# EAGLE design iv-12-tube-board-v2 (EAGLE 7.7.0)

## Sheet 1 of 2
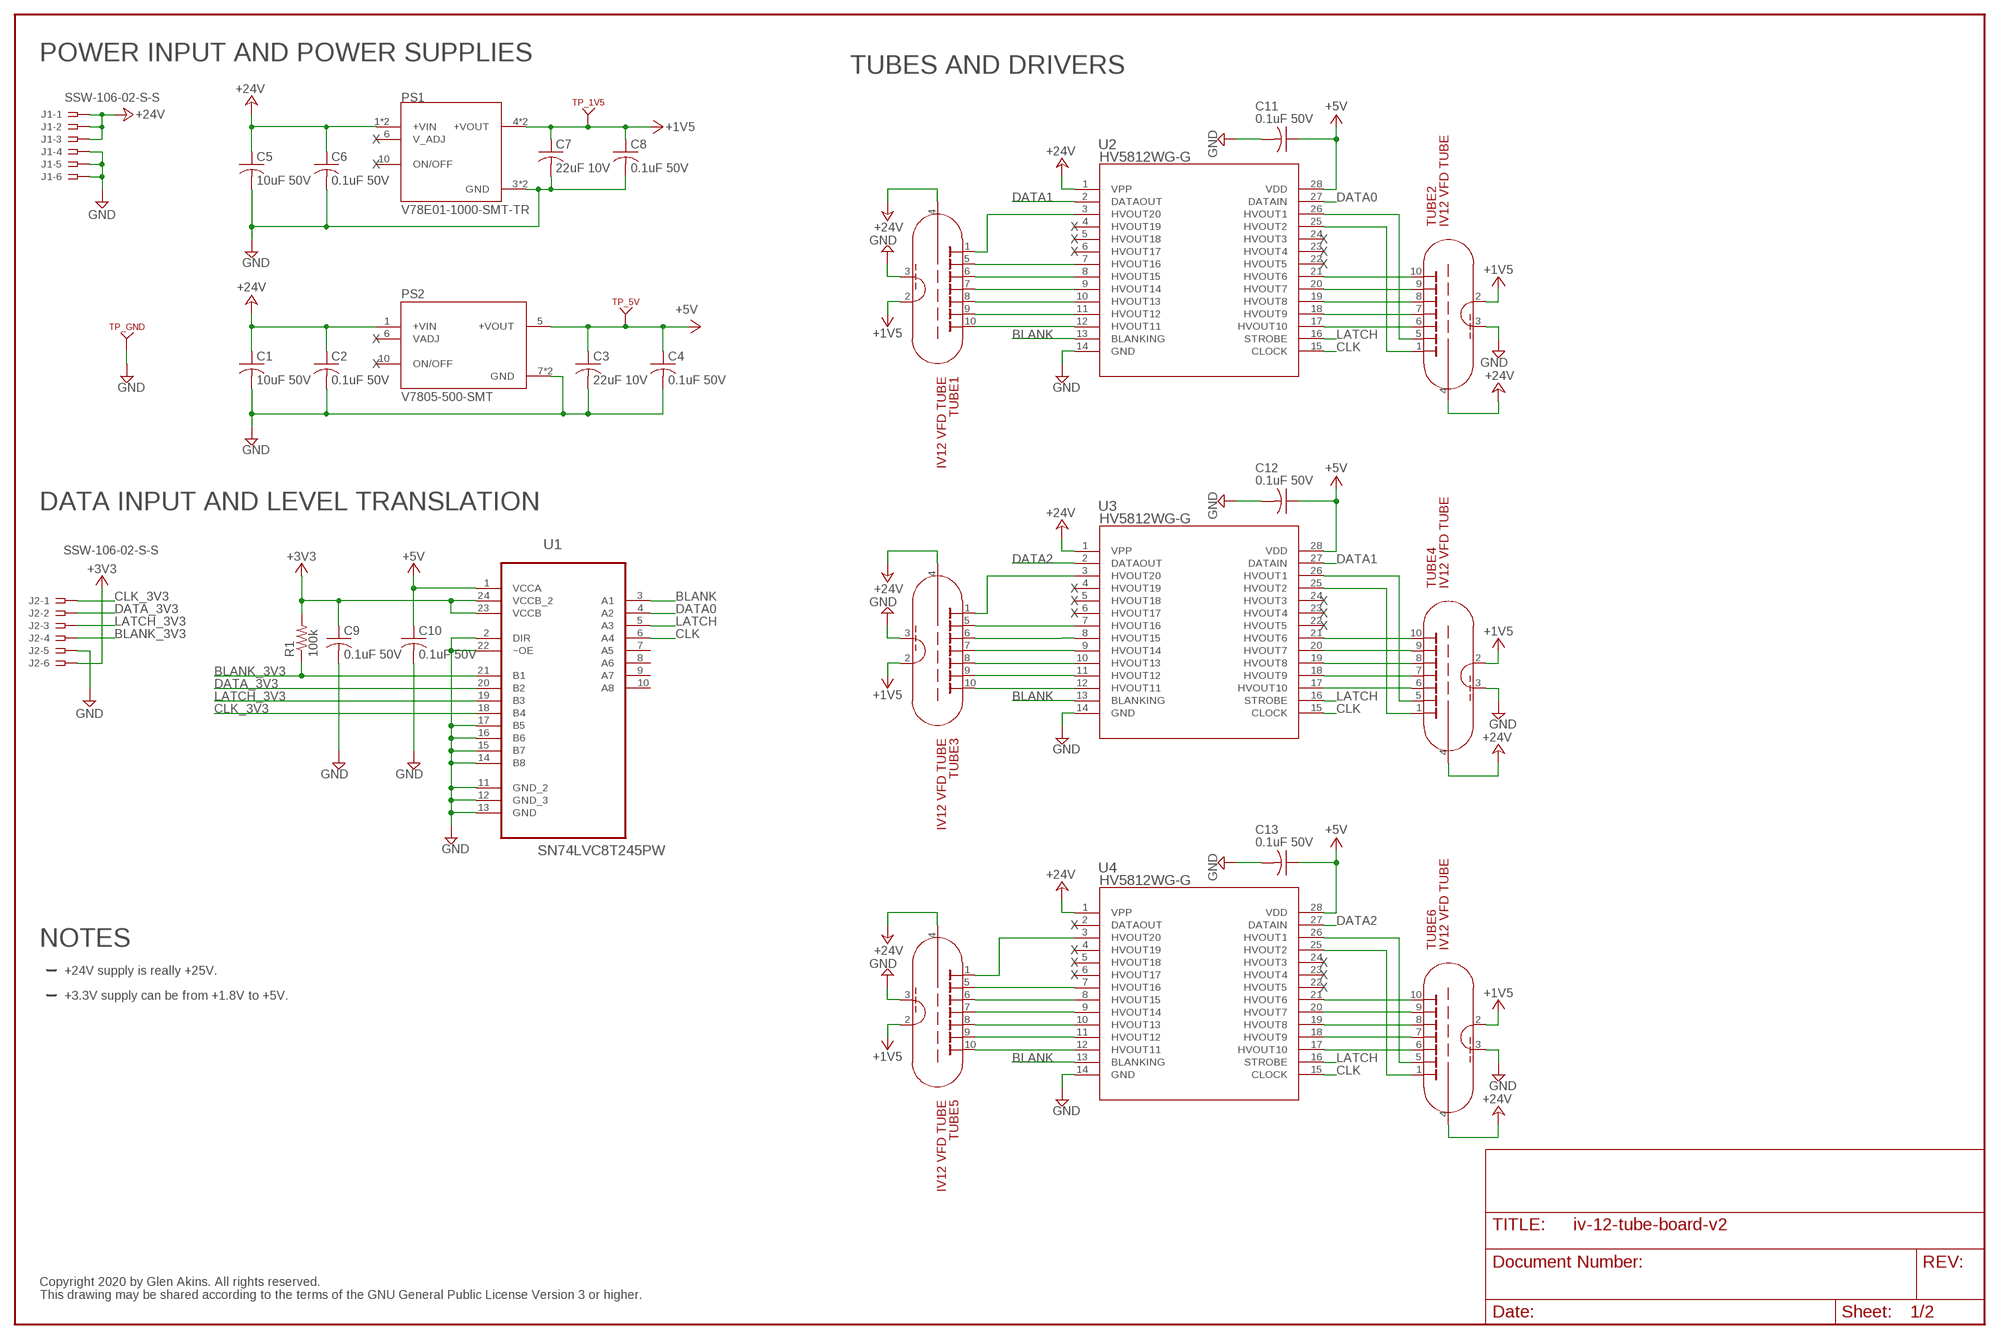
[diagram p0: schematic, sheet 1]

### Parts
C1  10uF 50V  C-USC1210K  [C1210K]
C2  0.1uF 50V  C-USC1206K  [C1206K]
C3  22uF 10V  C-USC1206K  [C1206K]
C4  0.1uF 50V  C-USC1206K  [C1206K]
C5  10uF 50V  C-USC1210K  [C1210K]
C6  0.1uF 50V  C-USC1206K  [C1206K]
C7  22uF 10V  C-USC1206K  [C1206K]
C8  0.1uF 50V  C-USC1206K  [C1206K]
C9  0.1uF 50V  C-USC0805K  [C0805K]
C10  0.1uF 50V  C-USC0805K  [C0805K]
C11  0.1uF 50V  C-USC0805  [C0805]
C12  0.1uF 50V  C-USC0805  [C0805]
C13  0.1uF 50V  C-USC0805  [C0805]
J1  SSW-106-02-S-S  [SSW-106-02-S-S]
J2  SSW-106-02-S-S  [SSW-106-02-S-S]
PS1  V78E01-1000-SMT-TR  [CONV_V78E01-1000-SMT-TR]
PS2  V7805-500-SMT  [CONV_V7805-500-SMT]
R1  100k  R-US_R0805  [R0805]
TP_1V5  KEYSTONE_500X  [KEYSTONE_TP500X]
TP_5V  KEYSTONE_500X  [KEYSTONE_TP500X]
TP_GND  KEYSTONE_500X  [KEYSTONE_TP500X]
TUBE1  IV12 VFD TUBE  IV-12-VFD-TUBE  [IV-12-VFD-TUBE-11.9MM-10PIN-34DEG]
TUBE2  IV12 VFD TUBE  IV-12-VFD-TUBE  [IV-12-VFD-TUBE-11.9MM-10PIN-34DEG]
TUBE3  IV12 VFD TUBE  IV-12-VFD-TUBE  [IV-12-VFD-TUBE-11.9MM-10PIN-34DEG]
TUBE4  IV12 VFD TUBE  IV-12-VFD-TUBE  [IV-12-VFD-TUBE-11.9MM-10PIN-34DEG]
TUBE5  IV12 VFD TUBE  IV-12-VFD-TUBE  [IV-12-VFD-TUBE-11.9MM-10PIN-34DEG]
TUBE6  IV12 VFD TUBE  IV-12-VFD-TUBE  [IV-12-VFD-TUBE-11.9MM-10PIN-34DEG]
U1  SN74LVC8T245PW  SN74AVC8T245PW  [SOP65P640X120-24N]
U2  HV5812WG-G  [SOW28_17P90X7P50]
U3  HV5812WG-G  [SOW28_17P90X7P50]
U4  HV5812WG-G  [SOW28_17P90X7P50]

### Nets
+1V5: C7.1 C8.1 PS1.4(+VOUT) PS1.5(+VOUT) TP_1V5.1 TUBE1.2 TUBE2.2 TUBE3.2 TUBE4.2 TUBE5.2 TUBE6.2
+3V3: C9.1 J2.6 R1.2 U1.23(VCCB) U1.24(VCCB_2)
+5V: C3.1 C4.1 C10.1 C11.1 C12.1 C13.1 PS2.5(+VOUT) TP_5V.1 U1.1(VCCA) U2.28(VDD) U3.28(VDD) U4.28(VDD)
+24V: C1.1 C2.1 C5.1 C6.1 J1.1 J1.2 J1.3 PS1.1(+VIN) PS1.2(+VIN) PS2.1(+VIN) TUBE1.4 TUBE2.4 TUBE3.4 TUBE4.4 TUBE5.4 TUBE6.4 U2.1(VPP) U3.1(VPP) U4.1(VPP)
BLANK: U1.3(A1) U2.13(BLANKING) U3.13(BLANKING) U4.13(BLANKING)
BLANK_3V3: J2.4 R1.1 U1.21(B1)
CLK: U1.6(A4) U2.15(CLOCK) U3.15(CLOCK) U4.15(CLOCK)
CLK_3V3: J2.1 U1.18(B4)
DATA0: U1.4(A2) U2.27(DATAIN)
DATA1: U2.2(DATAOUT) U3.27(DATAIN)
DATA2: U3.2(DATAOUT) U4.27(DATAIN)
DATA_3V3: J2.2 U1.20(B2)
GND: C1.2 C2.2 C3.2 C4.2 C5.2 C6.2 C7.2 C8.2 C9.2 C10.2 C11.2 C12.2 C13.2 J1.4 J1.5 J1.6 J2.5 PS1.3(GND) PS1.7(GND) PS2.7(GND) PS2.9(GND) TP_GND.1 TUBE1.3 TUBE2.3 TUBE3.3 TUBE4.3 TUBE5.3 TUBE6.3 U1.2(DIR) U1.11(GND_2) U1.12(GND_3) U1.13(GND) U1.14(B8) U1.15(B7) U1.16(B6) U1.17(B5) U1.22(~OE) U2.14(GND) U3.14(GND) U4.14(GND)
LATCH: U1.5(A3) U2.16(STROBE) U3.16(STROBE) U4.16(STROBE)
LATCH_3V3: J2.3 U1.19(B3)
N$1: TUBE1.1 U2.3(HVOUT20)
N$2: TUBE1.10 U2.12(HVOUT11)
N$3: TUBE1.9 U2.11(HVOUT12)
N$4: TUBE1.8 U2.10(HVOUT13)
N$5: TUBE1.7 U2.9(HVOUT14)
N$6: TUBE1.6 U2.8(HVOUT15)
N$7: TUBE1.5 U2.7(HVOUT16)
N$8: TUBE2.1 U2.25(HVOUT2)
N$9: TUBE2.5 U2.26(HVOUT1)
N$10: TUBE2.6 U2.17(HVOUT10)
N$11: TUBE2.7 U2.18(HVOUT9)
N$12: TUBE2.8 U2.19(HVOUT8)
N$13: TUBE2.9 U2.20(HVOUT7)
N$14: TUBE2.10 U2.21(HVOUT6)
N$15: TUBE3.1 U3.3(HVOUT20)
N$16: TUBE5.1 U4.3(HVOUT20)
N$17: TUBE3.5 U3.7(HVOUT16)
N$18: TUBE3.6 U3.8(HVOUT15)
N$19: TUBE3.7 U3.9(HVOUT14)
N$20: TUBE3.8 U3.10(HVOUT13)
N$21: TUBE3.9 U3.11(HVOUT12)
N$22: TUBE3.10 U3.12(HVOUT11)
N$23: TUBE5.10 U4.12(HVOUT11)
N$24: TUBE5.9 U4.11(HVOUT12)
N$25: TUBE5.8 U4.10(HVOUT13)
N$26: TUBE5.7 U4.9(HVOUT14)
N$27: TUBE5.6 U4.8(HVOUT15)
N$28: TUBE5.5 U4.7(HVOUT16)
N$29: TUBE4.5 U3.26(HVOUT1)
N$30: TUBE4.1 U3.25(HVOUT2)
N$31: TUBE4.10 U3.21(HVOUT6)
N$32: TUBE4.9 U3.20(HVOUT7)
N$33: TUBE4.8 U3.19(HVOUT8)
N$34: TUBE4.7 U3.18(HVOUT9)
N$35: TUBE4.6 U3.17(HVOUT10)
N$36: TUBE6.6 U4.17(HVOUT10)
N$37: TUBE6.7 U4.18(HVOUT9)
N$38: TUBE6.8 U4.19(HVOUT8)
N$39: TUBE6.9 U4.20(HVOUT7)
N$40: TUBE6.10 U4.21(HVOUT6)
N$41: TUBE6.5 U4.26(HVOUT1)
N$42: TUBE6.1 U4.25(HVOUT2)
Unconnected: PS1.6(V_ADJ) PS1.10(ON/OFF) PS2.6(VADJ) PS2.10(ON/OFF) U1.7(A5) U1.8(A6) U1.9(A7) U1.10(A8) U2.4(HVOUT19) U2.5(HVOUT18) U2.6(HVOUT17) U2.22(HVOUT5) U2.23(HVOUT4) U2.24(HVOUT3) U3.4(HVOUT19) U3.5(HVOUT18) U3.6(HVOUT17) U3.22(HVOUT5) U3.23(HVOUT4) U3.24(HVOUT3) U4.2(DATAOUT) U4.4(HVOUT19) U4.5(HVOUT18) U4.6(HVOUT17) U4.22(HVOUT5) U4.23(HVOUT4) U4.24(HVOUT3)

### Notes on the sheet
- POWER INPUT AND POWER SUPPLIES
- TUBES AND DRIVERS
- X
- X
- X
- X | X
- X | X
- X
- X
- X
- DATA INPUT AND LEVEL TRANSLATION
- X
- X | X
- X | X
- X
- X
- NOTES
- X
- X | X
- +24V supply is really +25V. | X | X
- X
- +3.3V supply can be from +1.8V to +5V.
- Copyright 2020 by Glen Akins. All rights reserved.
  This drawing may be shared according to the terms of the GNU General Public License Version 3 or higher.

## Sheet 2 of 2
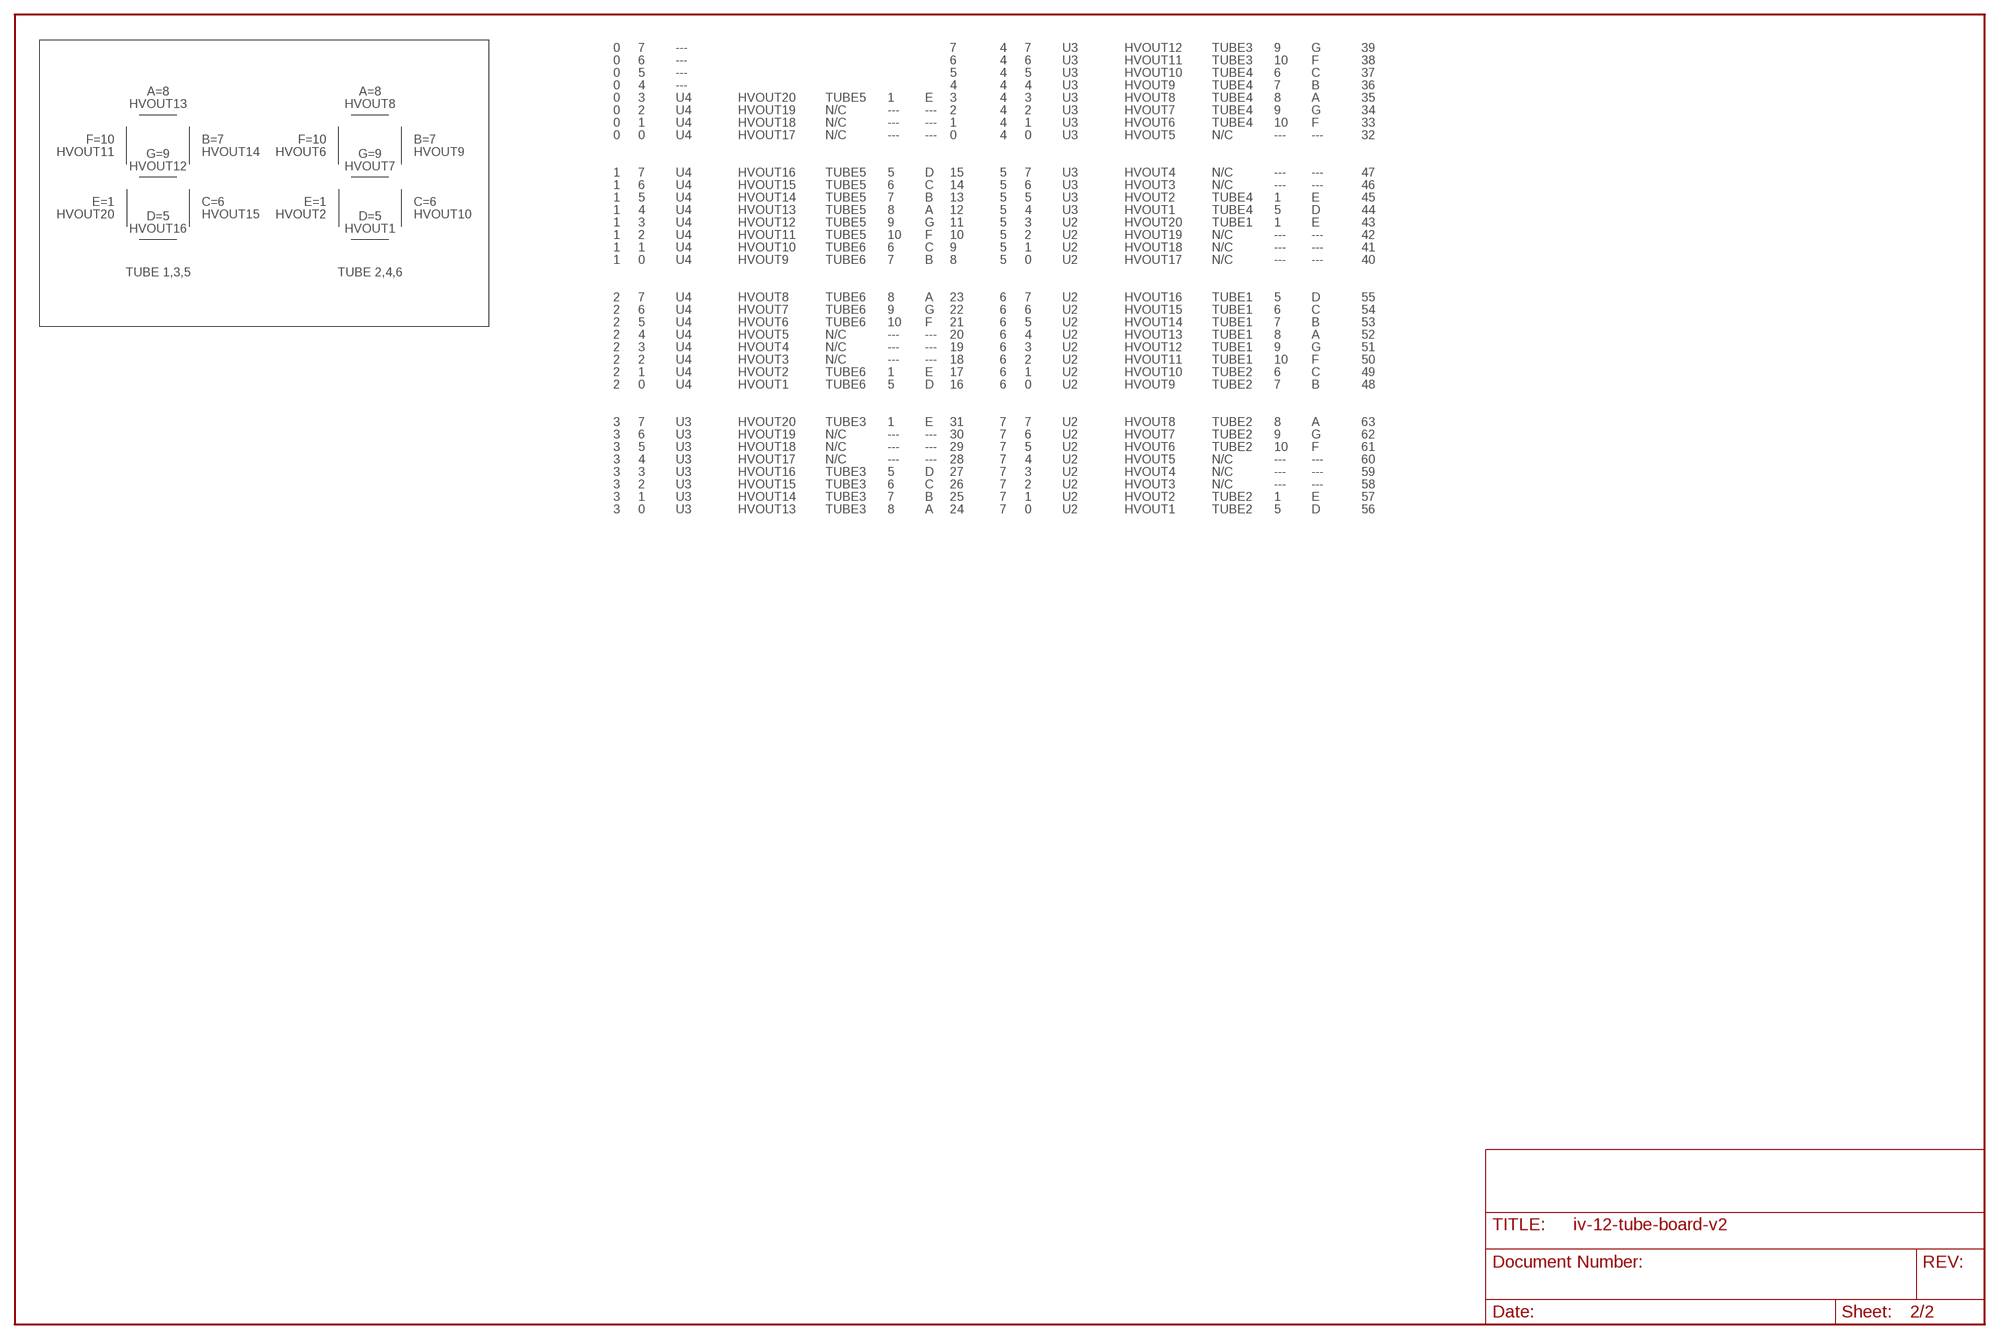
[diagram p1: schematic, sheet 2]

### Notes on the sheet
- 0 | 7 | --- | 7 | 4 | 7 | U3 | HVOUT12 | TUBE3 | 9 | G | 39
- 0 | 6 | --- | 6 | 4 | 6 | U3 | HVOUT11 | TUBE3 | 10 | F | 38
- 0 | 5 | --- | 5 | 4 | 5 | U3 | HVOUT10 | TUBE4 | 6 | C | 37
- 0 | 4 | --- | 4 | 4 | 4 | U3 | HVOUT9 | TUBE4 | 7 | B | 36
- A=8 | A=8
- 0 | 3 | U4 | HVOUT20 | TUBE5 | 1 | E | 3 | 4 | 3 | U3 | HVOUT8 | TUBE4 | 8 | A | 35
- HVOUT13 | HVOUT8
- 0 | 2 | U4 | HVOUT19 | N/C | --- | --- | 2 | 4 | 2 | U3 | HVOUT7 | TUBE4 | 9 | G | 34
- 0 | 1 | U4 | HVOUT18 | N/C | --- | --- | 1 | 4 | 1 | U3 | HVOUT6 | TUBE4 | 10 | F | 33
- F=10 | B=7 | F=10 | B=7 | 0 | 0 | U4 | HVOUT17 | N/C | --- | --- | 0 | 4 | 0 | U3 | HVOUT5 | N/C | --- | --- | 32
- HVOUT11 | HVOUT14 | HVOUT6 | HVOUT9
- G=9 | G=9
- HVOUT12 | HVOUT7
- 1 | 7 | U4 | HVOUT16 | TUBE5 | 5 | D | 15 | 5 | 7 | U3 | HVOUT4 | N/C | --- | --- | 47
- 1 | 6 | U4 | HVOUT15 | TUBE5 | 6 | C | 14 | 5 | 6 | U3 | HVOUT3 | N/C | --- | --- | 46
- E=1 | C=6 | E=1 | C=6 | 1 | 5 | U4 | HVOUT14 | TUBE5 | 7 | B | 13 | 5 | 5 | U3 | HVOUT2 | TUBE4 | 1 | E | 45
- HVOUT20 | HVOUT15 | HVOUT2 | HVOUT10 | 1 | 4 | U4 | HVOUT13 | TUBE5 | 8 | A | 12 | 5 | 4 | U3 | HVOUT1 | TUBE4 | 5 | D | 44
- D=5 | D=5
- 1 | 3 | U4 | HVOUT12 | TUBE5 | 9 | G | 11 | 5 | 3 | U2 | HVOUT20 | TUBE1 | 1 | E | 43
- HVOUT16 | HVOUT1
- 1 | 2 | U4 | HVOUT11 | TUBE5 | 10 | F | 10 | 5 | 2 | U2 | HVOUT19 | N/C | --- | --- | 42
- 1 | 1 | U4 | HVOUT10 | TUBE6 | 6 | C | 9 | 5 | 1 | U2 | HVOUT18 | N/C | --- | --- | 41
- 1 | 0 | U4 | HVOUT9 | TUBE6 | 7 | B | 8 | 5 | 0 | U2 | HVOUT17 | N/C | --- | --- | 40
- TUBE 1,3,5 | TUBE 2,4,6
- 2 | 7 | U4 | HVOUT8 | TUBE6 | 8 | A | 23 | 6 | 7 | U2 | HVOUT16 | TUBE1 | 5 | D | 55
- 2 | 6 | U4 | HVOUT7 | TUBE6 | 9 | G | 22 | 6 | 6 | U2 | HVOUT15 | TUBE1 | 6 | C | 54
- 2 | 5 | U4 | HVOUT6 | TUBE6 | 10 | F | 21 | 6 | 5 | U2 | HVOUT14 | TUBE1 | 7 | B | 53
- 2 | 4 | U4 | HVOUT5 | N/C | --- | --- | 20 | 6 | 4 | U2 | HVOUT13 | TUBE1 | 8 | A | 52
- 2 | 3 | U4 | HVOUT4 | N/C | --- | --- | 19 | 6 | 3 | U2 | HVOUT12 | TUBE1 | 9 | G | 51
- 2 | 2 | U4 | HVOUT3 | N/C | --- | --- | 18 | 6 | 2 | U2 | HVOUT11 | TUBE1 | 10 | F | 50
- 2 | 1 | U4 | HVOUT2 | TUBE6 | 1 | E | 17 | 6 | 1 | U2 | HVOUT10 | TUBE2 | 6 | C | 49
- 2 | 0 | U4 | HVOUT1 | TUBE6 | 5 | D | 16 | 6 | 0 | U2 | HVOUT9 | TUBE2 | 7 | B | 48
- 3 | 7 | U3 | HVOUT20 | TUBE3 | 1 | E | 31 | 7 | 7 | U2 | HVOUT8 | TUBE2 | 8 | A | 63
- 3 | 6 | U3 | HVOUT19 | N/C | --- | --- | 30 | 7 | 6 | U2 | HVOUT7 | TUBE2 | 9 | G | 62
- 3 | 5 | U3 | HVOUT18 | N/C | --- | --- | 29 | 7 | 5 | U2 | HVOUT6 | TUBE2 | 10 | F | 61
- 3 | 4 | U3 | HVOUT17 | N/C | --- | --- | 28 | 7 | 4 | U2 | HVOUT5 | N/C | --- | --- | 60
- 3 | 3 | U3 | HVOUT16 | TUBE3 | 5 | D | 27 | 7 | 3 | U2 | HVOUT4 | N/C | --- | --- | 59
- 3 | 2 | U3 | HVOUT15 | TUBE3 | 6 | C | 26 | 7 | 2 | U2 | HVOUT3 | N/C | --- | --- | 58
- 3 | 1 | U3 | HVOUT14 | TUBE3 | 7 | B | 25 | 7 | 1 | U2 | HVOUT2 | TUBE2 | 1 | E | 57
- 3 | 0 | U3 | HVOUT13 | TUBE3 | 8 | A | 24 | 7 | 0 | U2 | HVOUT1 | TUBE2 | 5 | D | 56

## Library data of the parts
C1 C5 = rcl:C-US: CAPACITOR, American symbol; MFR: KEMET; MFR_PART_NO: C1210C106K5RACTU
C2 C4 C6 C8 = rcl:C-US: CAPACITOR, American symbol; MFR: KEMET; MFR_PART_NO: C1206S104M5RACTU
C3 C7 = rcl:C-US: CAPACITOR, American symbol; MFR: KEMET; MFR_PART_NO: C1206C226K8RAC7800
C9-C13 = rcl:C-US: CAPACITOR, American symbol
J1 J2 = con-samtec:SSW-106-02-S-S: THROUGH-HOLE .025" SQ POST SOCKET Source: Samtec SSW.pdf; MPN: SSW-106-02-S-S; OC_FARNELL: unknown; OC_NEWARK: 11P9416
PS1 = V78E01-1000-SMT-TR:V78E01-1000-SMT-TR: NON-ISOLATED DC SWITCHING REGULATOR; CUI_PURCHASE_URL: https://www.cui.com/product/dc-dc-converters/non-isolated/v78e-1000-smt-series?utm_source=snapeda.com&utm_medium=referral&utm_campaign=snapedaBOM; DESCRIPTION: 1 A Output Current, 6~36 Vdc Input, SMT, Non-Isolated, Dc-Dc Converter; DIGI-KEY_PART_NUMBER: 102-5030-1-ND; DIGI-KEY_PURCHASE_URL: https://www.digikey.com/product-detail/en/cui-inc/V78E01-1000-SMT-TR/102-5030-1-ND/9649681?utm_source=snapeda&utm_medium=aggregator&utm_campaign=symbol; MF: CUI Inc.; MP: V78E01-1000-SMT-TR; PACKAGE: SMD-10 CUI Inc.
PS2 = V7805-500-SMT:V7805-500-SMT: 1 A Output Current, 4.5~18 Vdc Input, SMT, Non-Isolated, Dc-Dc Converter; MANUFACTURER: CUI Inc; PARTREV: 1.03; STANDARD: Manufacturer recommendations
R1 = rcl:R-US_: RESISTOR, American symbol
TP_1V5 TP_5V TP_GND = 0GlenConnectors:KEYSTONE_500X
TUBE1-TUBE6 = IV-12-VFD-TUBE:IV-12-VFD-TUBE
U1 = Texas Instruments_By_element14_Batch_1:SN74AVC8T245PW: TRANSCEIVER; MPN: SN74AVC8T245PW; OC_FARNELL: 1053490; OC_NEWARK: 10J9626; PACKAGE: TSSOP-24; SUPPLIER: Texas Instruments
U2-U4 = HV5812WG:HV5812WG-G; BUILT_BY: EMA_Jessica; COPYRIGHT: Copyright (C) 2018 Accelerated Designs. All rights reserved; MANUFACTURER_PART_NUMBER: HV5812WG-G; VENDOR: Microchip

## Board
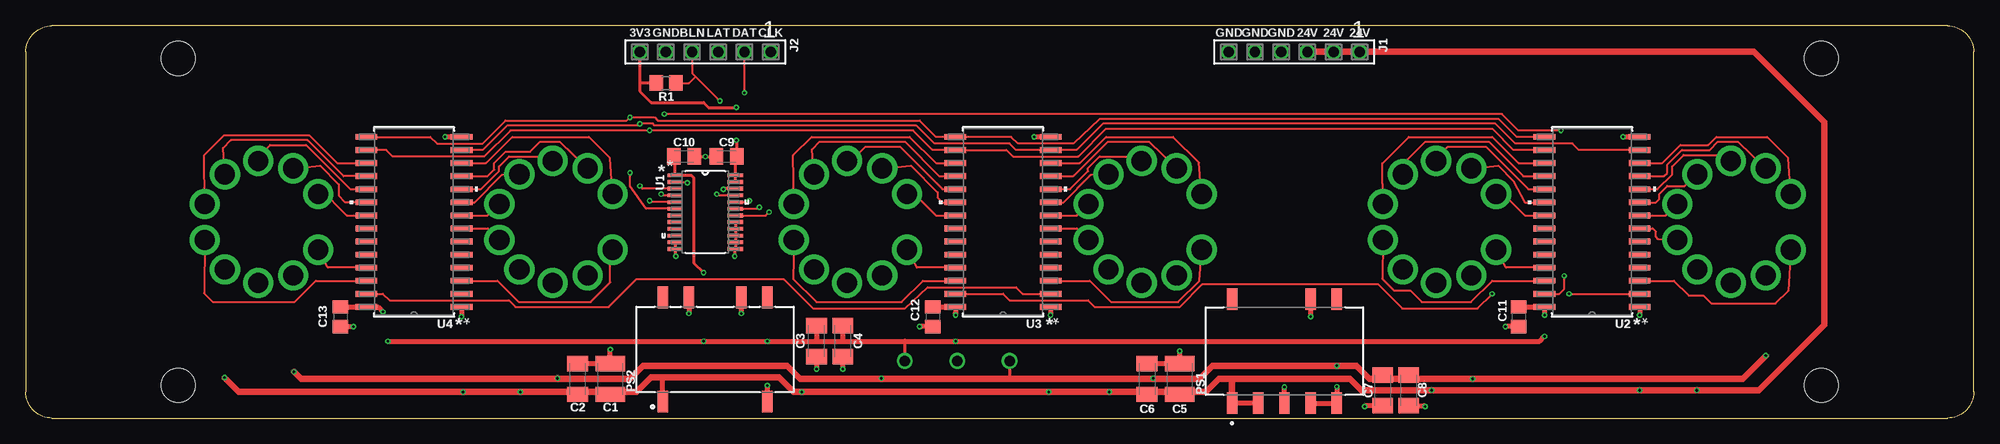
[diagram p2: board, top side]
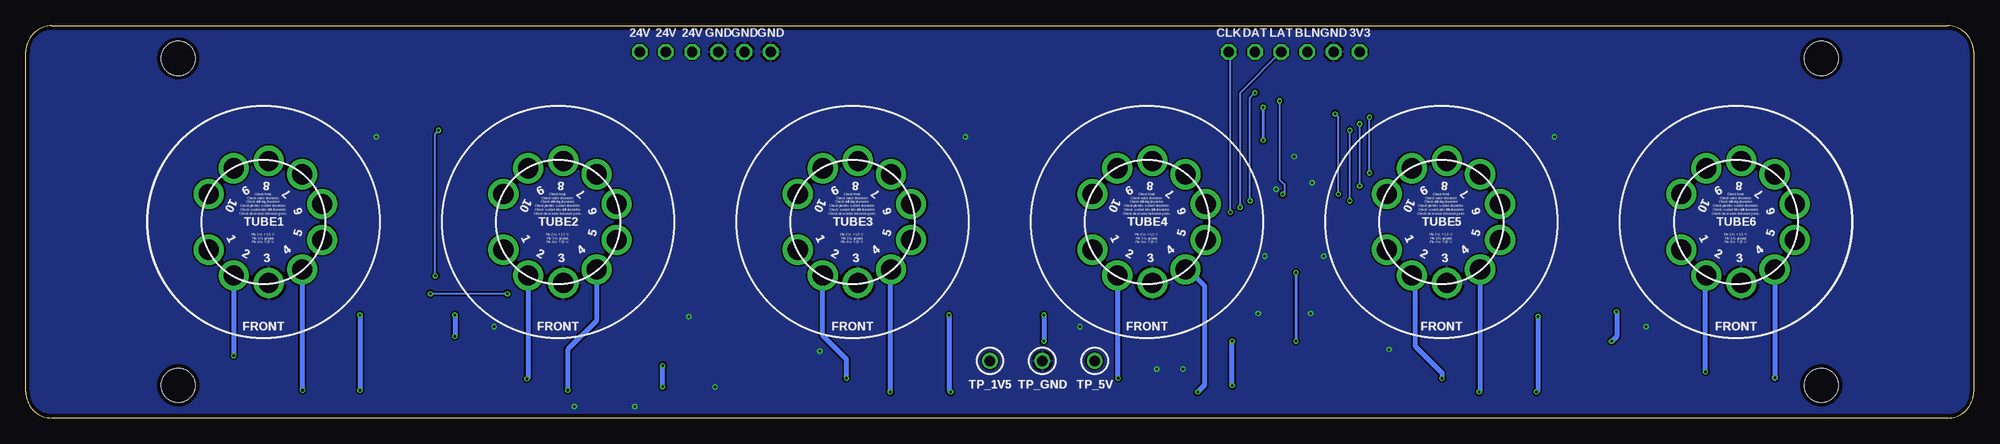
[diagram p3: board, bottom side, seen from below]

Size 189 x 38.1 mm. Coordinates in mm from the lower left corner, seen from the top.
Outline: 2.54,0 186.46,0 arc90 189,2.54 189,35.56 arc90 186.46,38.1 2.54,38.1 arc90 0,35.56 0,2.54 arc90 2.54,0
Copper layers (1*16): Top 0.035559375mm / dielectric 1.6mm / Bottom 0.035559375mm
Design rules "oshpark-2layer-2018": minimum track width 6mil, minimum drill 10mil, track to track 6mil, track to pad 6mil, pad to pad 6mil, via to via 6mil, smd to smd 6mil, copper to edge 15mil, drill to drill 6mil, minimum pad ring 5mil, minimum via ring 5mil, stop-mask expansion 2.5mil, vias tented up to drill 0mil, thermal gap 10mil
Holes 3.3 mm at 14.81,3.17 174.19,3.17 174.19,34.92 14.81,34.92

### Footprints (pad centres in the part's own frame; a part is rotated, then mirrored left to right if it is on the bottom)
C1210K = smd 1.5 x 2.9: 1 -1.5,0; 2 1.5,0
C1206K = smd 1.5 x 2: 1 -1.5,0; 2 1.5,0
C0805K = smd 1.3 x 1.6: 1 -1,0; 2 1,0
C0805 = smd 1.3 x 1.5: 1 -0.95,0; 2 0.95,0
SSW-106-02-S-S = drill 1 pad 1.5 octagon: 1 -6.35,0; 2 -3.81,0; 3 -1.27,0; 4 1.27,0; 5 3.81,0; 6 6.35,0
CONV_V78E01-1000-SMT-TR = smd 2.1 x 1: 1 -5.05,5.08; 2 -5.05,2.54; 3 -5.05,0; 4 -5.05,-2.54; 5 -5.05,-5.08; 6 5.05,-5.08; 7 5.05,-2.54; 10 5.05,5.08
CONV_V7805-500-SMT = smd 2.1 x 1: 1 -5.05,5.08; 5 -5.05,-5.08; 6 5.05,-5.08; 7 5.05,-2.54; 9 5.05,2.54; 10 5.05,5.08
R0805 = smd 1.3 x 1.5: 1 -0.95,0; 2 0.95,0
KEYSTONE_TP500X = drill 1.016: 1 0,0
IV-12-VFD-TUBE-11.9MM-10PIN-34DEG = drill 1.95 pad 2.85: 1 -5.301,-2.701; 2 -2.885,-5.204; 3 0.519,-5.927; 4 3.744,-4.624; 5 5.69,-1.74; 6 5.69,1.74; 7 3.744,4.624; 8 0.519,5.927; 9 -2.885,5.204; 10 -5.301,2.701
SOP65P640X120-24N = smd 1.473 x 0.356: 1 -2.921,3.581; 2 -2.921,2.921; 3 -2.921,2.286; 4 -2.921,1.626; 5 -2.921,0.965; 6 -2.921,0.33; 7 -2.921,-0.33; 8 -2.921,-0.965; 9 -2.921,-1.626; 10 -2.921,-2.286; 11 -2.921,-2.921; 12 -2.921,-3.581; 13 2.921,-3.581; 14 2.921,-2.921; 15 2.921,-2.286; 16 2.921,-1.626; 17 2.921,-0.965; 18 2.921,-0.33; 19 2.921,0.33; 20 2.921,0.965; 21 2.921,1.626; 22 2.921,2.286; 23 2.921,2.921; 24 2.921,3.581
SOW28_17P90X7P50 = smd 2.108 x 0.559: 1 -4.623,8.255; 2 -4.623,6.985; 3 -4.623,5.715; 4 -4.623,4.445; 5 -4.623,3.175; 6 -4.623,1.905; 7 -4.623,0.635; 8 -4.623,-0.635; 9 -4.623,-1.905; 10 -4.623,-3.175; 11 -4.623,-4.445; 12 -4.623,-5.715; 13 -4.623,-6.985; 14 -4.623,-8.255; 15 4.623,-8.255; 16 4.623,-6.985; 17 4.623,-5.715; 18 4.623,-4.445; 19 4.623,-3.175; 20 4.623,-1.905; 21 4.623,-0.635; 22 4.623,0.635; 23 4.623,1.905; 24 4.623,3.175; 25 4.623,4.445; 26 4.623,5.715; 27 4.623,6.985; 28 4.623,8.255

### Placement (x,y rotation side)
C1  56.72,3.81 90 top
C2  53.54,3.81 90 top
C3  76.72,7.46 270 top
C4  79.26,7.46 270 top
C5  111.96,3.81 90 top
C6  108.79,3.81 90 top
C7  131.65,2.7 270 top
C8  134.19,2.7 270 top
C9  67.99,25.4 180 top
C10  63.86,25.4 0 top
C11  144.82,9.84 270 top
C12  87.99,9.84 270 top
C13  30.52,9.84 270 top
J1  123.07,35.56 180 top
J2  65.92,35.56 180 top
PS1  122.12,6.51 90 top
PS2  66.88,6.67 90 top
R1  62.11,32.54 180 top
TP_1V5  95.45,5.56 180 bottom
TP_5V  85.29,5.56 180 bottom
TP_GND  90.37,5.56 180 bottom
TUBE1  165.94,19.05 0 bottom
TUBE2  137.36,19.05 0 bottom
TUBE3  108.79,19.05 0 bottom
TUBE4  80.21,19.05 0 bottom
TUBE5  51.64,19.05 0 bottom
TUBE6  23.06,19.05 0 bottom
U1  65.92,20 0 top
U2  151.97,19.05 180 top
U3  94.82,19.05 180 top
U4  37.67,19.05 180 top

### Tracks (layer width: path | path; a pad name or v marks a point on that pad's centre or on a via)
+1V5  (via drill 0.25)
  Top 0.305: TP_1V5.1 95.45,3.81
  Top 0.508: v109.37,3.86 111.33,3.81 | v83.02,3.86 82.75,3.81 | PS1.4 PS1.5 v127.2,3.05 | C7.1 131.89,4.2 132.28,3.81 | C8.1 133.94,4.2
  Top 0.61: v26.03,4.49 26.71,3.81 54.18,3.81 | 54.18,3.81 58.62,3.81 59.89,5.08 73.86,5.08 75.13,3.81 82.75,3.81 95.45,3.81 111.33,3.81 113.87,3.81 115.14,5.08 v127.2,5.08 129.11,5.08 130.38,3.81 132.28,3.81 133.55,3.81 | 133.55,3.81 v140.38,3.81 166.57,3.81 168.43,5.67 v168.82,6.06 | v51.59,3.86 54.18,3.81 | 133.94,4.2 133.55,3.81
  Bottom 0.508: v51.59,3.86 51.59,4.4 54.18,6.99 54.18,13.5 TUBE5.2 | v109.37,3.86 109.37,5.71 111.67,8.01 TUBE3.2 | v127.2,3.05 v127.2,5.08 | v26.03,4.49 26.03,13.76 TUBE6.2 | v83.02,3.86 83.02,13.77 TUBE4.2 | TUBE2.2 140.25,3.94 v140.38,3.81 | TUBE1.2 v168.82,6.06
+3V3  (via drill 0.25)
  Top 0.203: 68.84,25.26 C9.1 68.94,25.45
  Top 0.305: 68.84,25.26 U1.24 U1.23 | J2.6 59.57,32.54 | 59.57,32.54 59.57,31.75 60.69,30.64 65.77,30.64 66.24,30.16 v68.94,30.16 | v68.94,26.99 68.94,25.45 | R1.2 59.57,32.54
  Bottom 0.305: v68.94,30.16 v68.94,26.99
+5V  (via drill 0.25)
  Top 0.203: 63,25.26 C10.1
  Top 0.305: 63,25.26 U1.1 64.57,23.58 64.81,23.34 64.81,15.08 v65.77,14.13 | TP_5V.1 85.29,7.46
  Top 0.508: v34.65,10.32 34.17,10.79 U4.28 C13.1 | v35.13,7.46 v65.77,7.46 v71.96,7.46 76.88,7.46 | 76.88,7.46 79.26,7.46 | 79.26,7.46 85.29,7.46 v90.21,7.46 146.89,7.46 v147.36,7.94 | v147.36,10 147.34,10.02 U2.28 C11.1 | v90.21,10 90.19,10.18 U3.28 C12.1 | PS2.5 v71.96,3.17 | C3.1 76.72,7.62 76.88,7.46 | C4.1 79.26,7.46
  Bottom 0.305: v65.77,14.13 v65.77,7.46
  Bottom 0.508: v34.65,10.32 34.65,7.94 v35.13,7.46 | v147.36,10 v147.36,7.94 | v90.21,10 v90.21,7.46 | v71.96,3.17 v71.96,7.46
+24V  (via drill 0.25)
  Top 0.508: PS1.2 PS1.1 | C5.1 111.96,2.38 112.12,2.54 | C1.1 56.31,2.31 56.08,2.54 | C2.1 53.54,2.54 | U2.1 156.59,10.02 v156.57,10 | U3.1 99.44,10.02 v99.42,10 | U4.1 42.29,9.86 v42.27,9.84 | PS2.1 61.8,3.97
  Top 0.61: v19.29,3.93 20.68,2.54 v42.43,2.54 v47.99,2.54 53.54,2.54 56.08,2.54 59.26,2.54 60.69,3.97 61.8,3.97 73.07,3.97 74.5,2.54 v75.29,2.54 v99.26,2.54 v105.14,2.54 108.79,2.54 | 108.79,2.54 112.12,2.54 114.5,2.54 115.77,3.81 117.04,3.81 | 117.04,3.81 128.47,3.81 129.58,2.7 v136.41,2.7 v156.57,2.7 v162.13,2.7 168.16,2.7 174.51,9.05 174.51,28.73 167.68,35.56 J1.1 J1.2 J1.3 | PS1.1 117.04,3.81 | C6.1 108.79,2.54
  Bottom 0.508: TUBE4.4 76.28,14.49 74.66,12.86 74.66,3.17 v75.29,2.54 | v136.41,2.7 136.41,6.67 133.62,9.46 TUBE2.4 | v156.57,10 v156.57,2.7 | v99.42,10 99.42,2.7 v99.26,2.54 | v42.27,9.84 42.27,2.7 v42.43,2.54 | TUBE6.4 19.32,3.96 | TUBE5.4 47.89,2.63 v47.99,2.54 | TUBE3.4 105.14,14.33 v105.14,2.54 | TUBE1.4 162.19,2.76 v162.13,2.7
  Bottom 0.61: 19.32,3.96 v19.29,3.93
BLANK  (via drill 0.25)
  Top 0.203: U2.13 150.7,26.04 150.06,26.67 144.51,26.67 142.6,28.57 104.5,28.57 101.96,26.04 U3.13 96.09,26.04 95.45,26.67 88.15,26.67 86.4,28.42 61,28.42 60.84,28.57 v59.57,28.57 59.42,28.42 46.72,28.42 44.33,26.04 U4.13 | U1.3 59.83,22.29 v59.57,22.54
  Bottom 0.203: v59.57,22.54 v59.57,28.57
BLANK_3V3  (via drill 0.25)
  Top 0.203: U1.21 67.16,21.63 v67.04,21.75 | J2.4 64.66,33.5 64.97,33.18 | 64.97,33.18 v67.35,30.8 | R1.1 64.34,32.54 64.97,33.18
  Bottom 0.203: v67.35,30.8 67.35,23.18 66.88,22.7 66.88,21.91 v67.04,21.75
CLK  (via drill 0.25)
  Top 0.203: U2.15 144.66,27.3 142.92,29.05 104.18,29.05 101.64,26.67 96.25,26.67 95.61,27.3 U3.15 88.31,27.3 86.72,28.89 61.32,28.89 61,29.21 v58.62,29.21 58.31,28.89 46.56,28.89 44.33,26.67 39.89,26.67 39.25,27.3 U4.15 | U1.6 60.2,20.33 58.62,22.54 v58.62,23.81
  Bottom 0.203: v58.62,23.81 v58.62,29.21
CLK_3V3  (via drill 0.25)
  Top 0.203: U1.18 71.79,19.67 v72.12,20
  Bottom 0.203: v72.12,20 72.12,35.4 J2.1
DATA0  (via drill 0.25)
  Top 0.203: U2.27 148.79,12.06 149.27,12.54 v149.27,13.81 | v148.95,27.94 144.82,27.94 143.24,29.53 v61.96,29.53 | U1.4 61.76,21.63 v61.64,21.75
  Bottom 0.203: v149.27,13.81 149.27,27.62 v148.95,27.94 | v61.64,21.75 61.64,29.21 v61.96,29.53
DATA1  (via drill 0.25)
  Top 0.203: U3.27 94.82,12.06 95.45,11.43 103.07,11.43 103.71,10.79 111.96,10.79 114.18,13.02 131.17,13.02 133.55,10.64 140.85,10.64 v142.28,12.06 | v149.74,12.06 U2.2
  Bottom 0.203: v142.28,12.06 v149.74,12.06
DATA2
  Top 0.203: U4.27 34.65,12.06 35.29,11.43 46.88,11.43 47.51,10.79 56.56,10.79 59.26,13.49 73.55,13.49 76.4,10.64 85.29,10.64 87.51,12.7 96.09,12.7 96.72,12.06 U3.2
DATA_3V3  (via drill 0.25)
  Top 0.203: U1.20 70.06,20.97 v70.21,21.11 | v69.73,31.59 J2.2
  Bottom 0.203: v70.21,21.11 70.21,31.11 v69.73,31.59
GND  (via drill 0.25)
  Top 0.203: U1.13 68.84,16.45 68.78,16.51 | U1.2 64.11,22.92 v64.18,22.86
  Top 0.305: C10.2 v65.92,25.4 C9.2 | U1.17 U1.16 U1.15 U1.14 U1.13 | 68.78,16.51 v68.78,15.72 | U1.11 U1.12 63,15.78 v63.07,15.72 | U1.22 67.73,22.29 v67.67,22.23
  Top 0.508: PS2.7 v69.42,10.16 | PS2.9 v64.34,10.16 | PS1.7 v124.66,9.84 | PS1.3 v122.12,3.02 | C7.2 129.99,1.2 v129.9,1.11 | C8.2 135.69,1.2 v135.77,1.11 | C2.2 C1.2 v56.72,6.67 | v111.96,6.51 C5.2 C6.2 | U4.14 v40.68,27.3 | U3.14 v97.83,27.3 | U2.14 v154.98,27.3 | C4.2 v79.26,4.76 | C3.2 v76.72,4.76 | C12.2 86.88,8.89 v86.72,8.89 | C13.2 v31.79,8.89 | C11.2 v143.56,8.89 v143.55,8.89
  pour Bottom (isolate 0.152): 0,1.27 1.27,0 187.73,0 189,1.27 189,36.83 187.73,38.1 1.27,38.1 0,36.83
LATCH  (via drill 0.25)
  Top 0.203: U2.16 144.35,26.04 142.28,28.1 104.82,28.1 102.12,25.4 95.77,25.4 95.13,26.04 U3.16 87.99,26.04 86.09,27.94 v60.53,27.94 47.03,27.94 44.49,25.4 35.6,25.4 34.97,26.04 U4.16 | U1.5 60.67,20.97 v60.53,21.11
  Bottom 0.203: v60.53,21.11 v60.53,27.94
LATCH_3V3  (via drill 0.25)
  Top 0.203: U1.19 71.02,20.33 v71.16,20.48
  Bottom 0.203: v71.16,20.48 71.16,31.59 J2.3
N$1
  Top 0.203: U2.3 159.9,13.34 161.33,11.91 162.76,11.91 163.56,11.11 169.75,11.11 170.98,12.35 TUBE1.1
N$2
  Top 0.203: U2.12 158.79,24.77 160.54,26.51 163.24,26.51 164.03,27.3 168.95,27.3 170.98,25.27 TUBE1.10
N$3
  Top 0.203: U2.11 158.95,23.5 159.27,23.81 159.27,24.61 160.7,26.04 163.4,26.04 164.19,26.83 166.11,26.83 TUBE1.9
N$4
  Top 0.203: U2.10 158.32,22.23 159.75,23.65 159.75,24.45 160.86,25.56 164.51,25.56 TUBE1.8
N$5
  Top 0.203: U2.9 158.16,20.95 158.48,21.27 158.48,21.75 159.27,22.54 160.97,22.54 TUBE1.7
N$6
  Top 0.203: U2.8 159.12,19.68 TUBE1.6
N$7
  Top 0.203: U2.7 157.84,18.41 158.16,18.1 158.16,17.62 158.42,17.36 TUBE1.5
N$8
  Top 0.203: U2.25 143.61,14.61 TUBE2.1
N$9
  Top 0.203: TUBE2.5 131.6,13.54 132.76,12.38 134.35,12.38 135.46,11.27 140.22,11.27 142.28,13.34 U2.26
N$10
  Top 0.203: TUBE2.6 131.6,24.72 134.19,27.3 142.28,27.3 144.82,24.77 U2.17
N$11
  Top 0.203: TUBE2.7 133.43,24.49 135.77,26.83 141.97,26.83 145.3,23.5 U2.18
N$12
  Top 0.203: TUBE2.8 136.63,24.99 138,26.35 141.65,26.35 145.78,22.23 U2.19
N$13
  Top 0.203: TUBE2.9 142.86,24.51 144.35,23.02 145.46,20.95 U2.20
N$14
  Top 0.203: TUBE2.10 142.85,22.29 145.46,19.68 U2.21
N$15
  Top 0.203: U3.3 103.23,13.34 105.29,11.27 111.8,11.27 113.87,13.34 113.84,13.37 TUBE3.1
N$16
  Top 0.203: U4.3 45.76,13.34 47.83,11.27 54.81,11.27 56.72,13.18 56.72,15.77 TUBE5.1
N$17
  Top 0.203: U3.7 101.98,18.41 TUBE3.5
N$18
  Top 0.203: U3.8 101.98,19.68 TUBE3.6
N$19
  Top 0.203: U3.9 100.69,20.95 103.32,23.58 TUBE3.7
N$20
  Top 0.203: U3.10 101.33,22.23 103.07,23.97 103.07,24.29 104.18,25.4 107.52,25.4 TUBE3.8
N$21
  Top 0.203: U3.11 101.64,23.5 104.98,26.83 108.96,26.83 TUBE3.9
N$22
  Top 0.203: U3.12 102.28,24.77 104.82,27.3 111.33,27.3 113.84,24.8 TUBE3.10
N$23
  Top 0.203: U4.12 44.65,24.77 47.19,27.3 54.65,27.3 56.68,25.27 TUBE5.10
N$24
  Top 0.203: U4.11 44.81,23.5 45.45,24.13 45.45,24.77 46.56,25.88 48.94,25.88 49.89,26.83 51.81,26.83 TUBE5.9
N$25
  Top 0.203: U4.10 44.18,22.23 45.92,23.97 45.92,24.45 46.88,25.4 50.37,25.4 TUBE5.8
N$26
  Top 0.203: U4.9 43.54,20.95 46.17,23.58 TUBE5.7
N$27
  Top 0.203: U4.8 44.83,19.68 TUBE5.6
N$28
  Top 0.203: U4.7 44.83,18.41 TUBE5.5
N$29
  Top 0.203: TUBE4.5 74.45,13.54 76.72,11.27 84.98,11.27 87.04,13.34 U3.26
N$30
  Top 0.203: U3.25 86.46,14.61 TUBE4.1
N$31
  Top 0.203: TUBE4.10 85.7,22.29 88.31,19.68 U3.21
N$32
  Top 0.203: TUBE4.9 85.87,24.51 88.47,21.91 88.47,21.43 88.94,20.95 U3.20
N$33
  Top 0.203: TUBE4.8 80.12,24.99 81.48,26.35 84.82,26.35 88.94,22.23 U3.19
N$34
  Top 0.203: TUBE4.7 76.28,26.07 77.04,26.83 85.29,26.83 88.63,23.5 U3.18
N$35
  Top 0.203: TUBE4.6 74.45,25.52 76.24,27.3 85.77,27.3 88.31,24.77 U3.17
N$36
  Top 0.203: TUBE6.6 17.3,25.52 19.25,27.46 27.51,27.46 30.21,24.77 U4.17
N$37
  Top 0.203: U4.18 30.84,23.5 27.35,26.99 19.89,26.99 19.13,26.23 TUBE6.7
N$38
  Top 0.203: TUBE6.8 22.21,25.02 23.7,26.51 27.19,26.51 31.48,22.23 U4.19
N$39
  Top 0.203: TUBE6.9 28.56,24.51 30.36,22.7 30.36,21.59 31,20.95 U4.20
N$40
  Top 0.203: TUBE6.10 28.55,22.29 31.16,19.68 U4.21
N$41
  Top 0.203: TUBE6.5 17.3,12.11 18.14,11.27 26.08,11.27 28.14,13.34 U4.26
N$42
  Top 0.203: U4.25 29.31,14.61 TUBE6.1

### Text on the board
_tsilk: 3V3 | GND | BLN | LAT | DAT | CLK | J2 | GND | GND | GND | 24V | 24V | 24V | J1 | R1 | C10 | C9 | * | U1 | C13 | U4 | C12 | U3 | U2 | * | * | C11 | * | C3 | C4 | PS2 | C7 | C8 | PS1 | C2 | C1 | C6 | C5
_bsilk: 3V3 | GND | BLN | LAT | DAT | CLK | GND | GND | GND | 24V | 24V | 24V | 8 | 9 | 8 | 9 | 8 | 9 | 8 | 9 | 8 | 9 | 8 | 9 | 7 | 7 | 7 | 7 | 7 | 7 | 10 | 10 | 10 | 10 | 10 | 10 | 6 | 6 | 6 | 6 | 6 | 6 | TUBE6 | TUBE5 | TUBE4 | TUBE3 | TUBE2 | TUBE1 | 5 | 5 | 5 | 5 | 5 | 5 | 1 | 1 | 1 | 1 | 1 | 1 | 4 | 2 | 4 | 2 | 4 | 2 | 4 | 2 | 4 | 2 | 4 | 2 | 3 | 3 | 3 | 3 | 3 | 3 | FRONT | FRONT | FRONT | FRONT | FRONT | FRONT | TP_5V | TP_GND | TP_1V5